# Altium schematic sheet 24MHz crystal oscillator 3v3 SMD.schdoc
size 124 x 99 mm
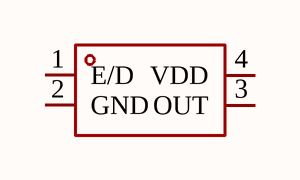
[diagram p0: 24MHz crystal oscillator 3v3 SMD.schdoc]

## Parts
X?  24MHz  [OSC-SMD_4P-L3.2-W2.5-BL]  (value not drawn)

## Nets

Not connected (* = marked no-connect by the designer): X? 1(E/D) 2(GND) 3(OUT) 4(VDD)

## Library data of the parts
X? = 830240003W1: Manufacturer: HD(浩都频率); Add into BOM: yes; Supply Voltage: 3.3V; Supply Current (Max): 10mA; Frequency Stability(Full temperature range): ±50ppm; Symbol: 830240003W1; Device: 830240003W1; LCSC Part Name: 830240003W1; Supplier Part: C655082; Manufacturer Part: 830240003W1; Supplier Footprint: SMD3225-4P; JLCPCB Part Class: Extended Part; Datasheet: https://atta.szlcsc.com/upload/public/pdf/source/20220223/C18A1C64EF3D60DAEF5D17439C785677.pdf; Supplier: LCSC; Convert to PCB: yes; Value: 24MHz; Operating Temperature: -20℃~+70℃